# Altium schematic sheet PC1_Codec.SchDoc
size A4
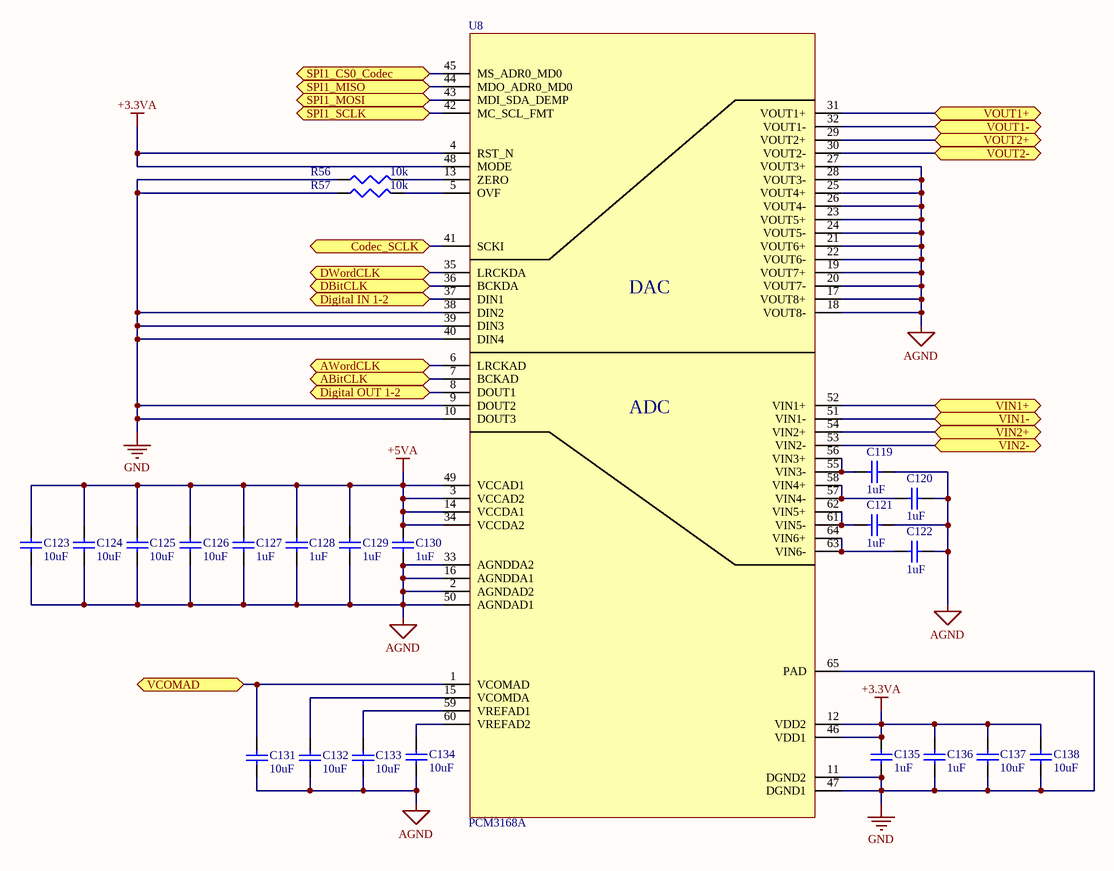
[diagram p0: PC1_Codec.SchDoc]

## Parts
C119  1uF  [CAPC1608X08]
C120  1uF  [CAPC1608X08]
C121  1uF  [CAPC1608X08]
C122  1uF  [CAPC1608X08]
C123  10uF  [CAPC1608X08]
C124  10uF  [CAPC1608X08]
C125  10uF  [CAPC1608X08]
C126  10uF  [CAPC1608X08]
C127  1uF  [CAPC1608X08]
C128  1uF  [CAPC1608X08]
C129  1uF  [CAPC1608X08]
C130  1uF  [CAPC1608X08]
C131  10uF  [CAPC1608X08]
C132  10uF  [CAPC1608X08]
C133  10uF  [CAPC1608X08]
C134  10uF  [CAPC1608X08]
C135  1uF  [CAPC1608X08]
C136  1uF  [CAPC1608X08]
C137  10uF  [CAPC1608X08]
C138  10uF  [CAPC1608X08]
R56  value 10k  [RESC1608X05]  (hidden comment: Res3)
R57  value 10k  [RESC1608X05]  (hidden comment: Res3)
U8  PCM3168A  [PAP64_7X7P26-M]

## Ports
ABitCLK, AWordCLK, Codec_SCLK, DBitCLK, Digital IN 1-2, Digital OUT 1-2, DWordCLK, SPI1_CS0_Codec, SPI1_MISO, SPI1_MOSI, SPI1_SCLK, VCOMAD, VIN1+, VIN1-, VIN2+, VIN2-, VOUT1+, VOUT1-, VOUT2+, VOUT2-

## Nets
+3.3VA: C135.2 C136.2 C137.1 C138.1 U8.4(RST_N) U8.12(VDD2) U8.46(VDD1) U8.48(MODE)
+5VA: C123.1 C124.1 C125.1 C126.1 C127.2 C128.2 C129.2 C130.2 U8.3(VCCAD2) U8.14(VCCDA1) U8.34(VCCDA2) U8.49(VCCAD1)
AGND: C119.1 C120.1 C121.1 C122.1 C123.2 C124.2 C125.2 C126.2 C127.1 C128.1 C129.1 C130.1 C131.2 C132.2 C133.2 C134.2 U8.2(AGNDAD2) U8.16(AGNDDA1) U8.17(VOUT8+) U8.18(VOUT8-) U8.19(VOUT7+) U8.20(VOUT7-) U8.21(VOUT6+) U8.22(VOUT6-) U8.23(VOUT5+) U8.24(VOUT5-) U8.25(VOUT4+) U8.26(VOUT4-) U8.27(VOUT3+) U8.28(VOUT3-) U8.33(AGNDDA2) U8.50(AGNDAD1)
GND: C135.1 C136.1 C137.2 C138.2 R56.1 R57.1 U8.9(DOUT2) U8.10(DOUT3) U8.11(DGND2) U8.38(DIN2) U8.39(DIN3) U8.40(DIN4) U8.47(DGND1) U8.65(PAD)
ABitCLK: U8.7(BCKAD) ; port ABitCLK
AWordCLK: U8.6(LRCKAD) ; port AWordCLK
Codec_SCLK: U8.41(SCKI) ; port Codec_SCLK
DBitCLK: U8.36(BCKDA) ; port DBitCLK
Digital IN 1-2: U8.37(DIN1) ; port Digital IN 1-2
Digital OUT 1-2: U8.8(DOUT1) ; port Digital OUT 1-2
DWordCLK: U8.35(LRCKDA) ; port DWordCLK
SPI1_CS0_Codec: U8.45(MS_ADR0_MD0) ; port SPI1_CS0_Codec
SPI1_MISO: U8.44(MDO_ADR0_MD0) ; port SPI1_MISO
SPI1_MOSI: U8.43(MDI_SDA_DEMP) ; port SPI1_MOSI
SPI1_SCLK: U8.42(MC_SCL_FMT) ; port SPI1_SCLK
VCOMAD: U8.1(VCOMAD) ; port VCOMAD
VIN1+: U8.52(VIN1+) ; port VIN1+
VIN1-: U8.51(VIN1-) ; port VIN1-
VIN2+: U8.54(VIN2+) ; port VIN2+
VIN2-: U8.53(VIN2-) ; port VIN2-
VOUT1+: U8.31(VOUT1+) ; port VOUT1+
VOUT1-: U8.32(VOUT1-) ; port VOUT1-
VOUT2+: U8.29(VOUT2+) ; port VOUT2+
VOUT2-: U8.30(VOUT2-) ; port VOUT2-
NetC119_2: C119.2 U8.55(VIN3-) U8.56(VIN3+)
NetC120_2: C120.2 U8.57(VIN4-) U8.58(VIN4+)
NetC121_2: C121.2 U8.61(VIN5-) U8.62(VIN5+)
NetC122_2: C122.2 U8.63(VIN6-) U8.64(VIN6+)
NetC132_1: C132.1 U8.15(VCOMDA)
NetC133_1: C133.1 U8.59(VREFAD1)
NetC134_1: C134.1 U8.60(VREFAD2)
NetR56_2: R56.2 U8.13(ZERO)
NetR57_2: R57.2 U8.5(OVF)

Not connected (* = marked no-connect by the designer): C131 1

## Notes on the sheet
- (in symbol PCM3168APAPR) DAC; ADC

## Library data of the parts
C119-C122 C127-C130 C135 C136 = Cap Semi: Capacitor; Fabricant: MURATA; Fournisseur: Farnell; RefFabricant: GRM188R60J105KA01D; RefFournisseur: 9527699; Value: 1uF; Case: 0603 [1608 Metric]; DataSheet: http://www.farnell.com/datasheets/2048127.pdf
C123-C126 C131-C134 C137 C138 = Cap Semi: Capacitor (Semiconductor SIM Model); Fabricant: MURATA; Fournisseur: Farnell; RefFabricant: GRM188R60J106ME47J; RefFournisseur: 2611921; Value: 10uF; Case: 0603 [1608 Metric]; DataSheet: http://www.farnell.com/datasheets/2079165.pdf
R56 R57 = Res3: Resistor; Fabricant: TE CONNECTIVITY; Fournisseur: Farnell; RefFabricant: CPF-A-0603B4K7E1; RefFournisseur: 2483933; Case: 0603 [1608 Metric]; DataSheet: http://www.farnell.com/datasheets/1935020.pdf
U8 = PCM3168APAPR: Codec Audio, 6ADC/8DAC; RefFournisseur: 2496455; Fournisseur: Farnell; Fabricant: TEXAS INSTRUMENTS; RefFabricant: PCM3168APAP; DataSheet: http://www.ti.com/lit/ds/symlink/pcm3168a.pdf